# EAGLE schematic Pre_schV2 (EAGLE 9.6.2)
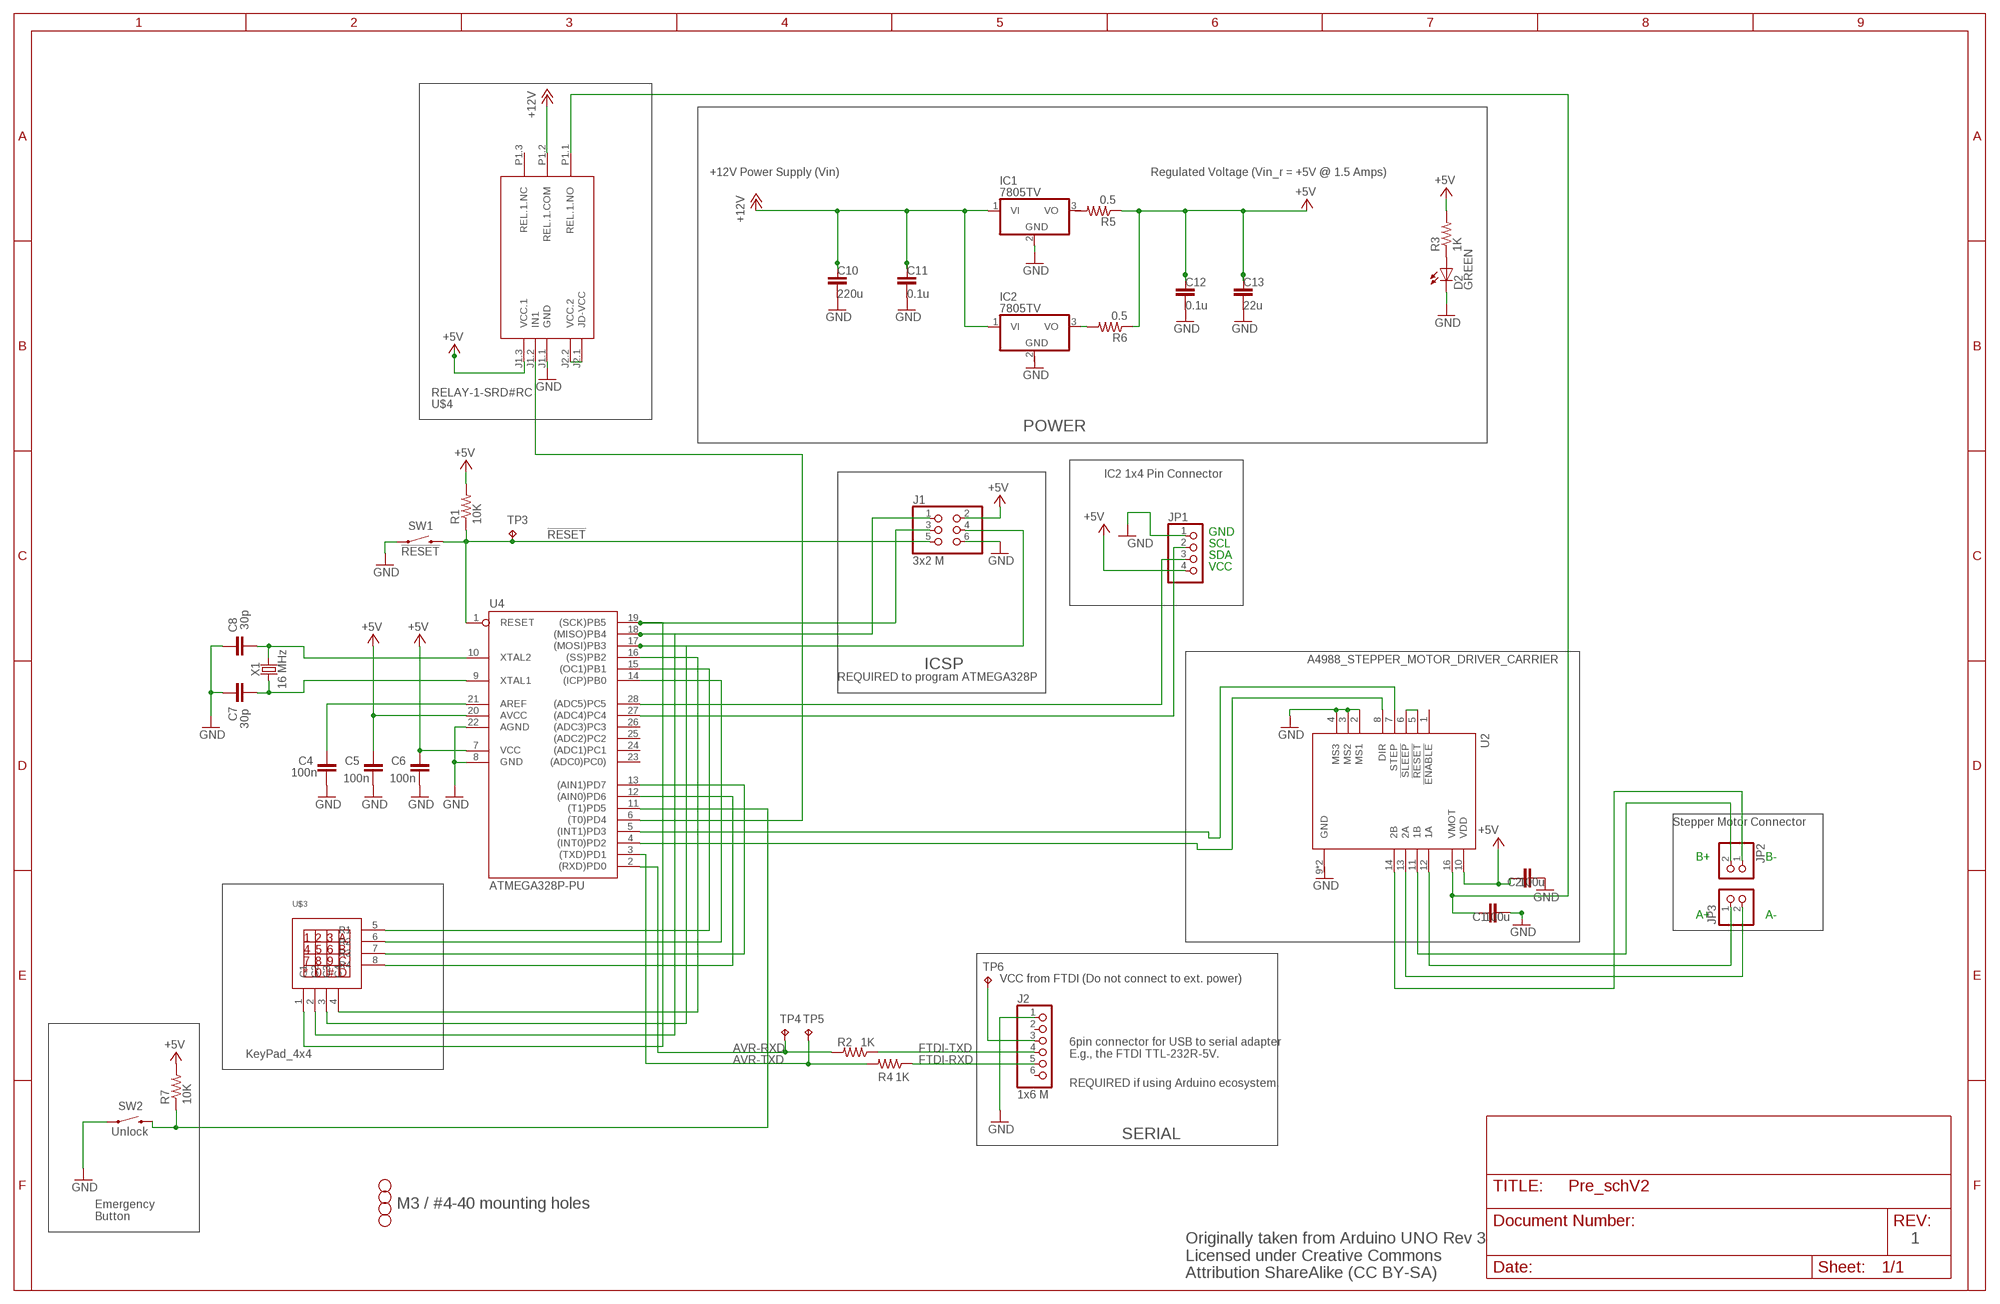
[diagram p0: schematic, sheet 1]

## Parts
C1  100u  C-EUC0805K  [C0805K]
C2  100u  C-EUC0805K  [C0805K]
C4  100n  C-EUC0805K  [C0805K]
C5  100n  C-EUC0805K  [C0805K]
C6  100n  C-EUC0805K  [C0805K]
C7  30p  C-EUC0805K  [C0805K]
C8  30p  C-EUC0805K  [C0805K]
C10  220u  C-EUC0805K  [C0805K]
C11  0.1u  C-EUC0805K  [C0805K]
C12  0.1u  C-EUC0805K  [C0805K]
C13  22u  C-EUC0805K  [C0805K]
D2  GREEN  LEDCHIP-LED0805  [CHIP-LED0805]
H1  STAND-OFF  [STAND-OFF]
H2  STAND-OFF  [STAND-OFF]
H3  STAND-OFF  [STAND-OFF]
H4  STAND-OFF  [STAND-OFF]
IC1  7805TV  [TO220V]
IC2  7805TV  [TO220V]
J1  3x2 M  PINHD-2X3  [2X03]
J2  1x6 M  PINHD-1X6  [1X06]
JP1  PINHD-1X4  [1X04]
JP2  PINHD-1X2  [1X02]
JP3  PINHD-1X2  [1X02]
R1  10K  R-US_R0805  [R0805]
R2  1K  R-US_R0805  [R0805]
R3  1K  R-US_R0805  [R0805]
R4  1K  R-US_R0805  [R0805]
R5  0.5  R-US_R0805  [R0805]
R6  0.5  R-US_R0805  [R0805]
R7  10K  R-US_R0805  [R0805]
SW1  !RESET  SWITCH-MOMENTARY-2SMD  [TACTILE_SWITCH_SMD]
SW2  Unlock  SWITCH-MOMENTARY-2SMD  [TACTILE_SWITCH_SMD]
TP3  TPPAD1-13  [P1-13]
TP4  TPPAD1-13  [P1-13]
TP5  TPPAD1-13  [P1-13]
TP6  TPPAD1-13  [P1-13]
U2  A4988_STEPPER_MOTOR_DRIVER_CARRIER  [MODULE_A4988_STEPPER_MOTOR_DRIVER_CARRIER]
U4  ATMEGA328P-PU  [DIL28-3]
U$3  KEYPAD4X4  [KEYPAD4X4]
U$4  RELAY-1-SRD#RC  [RELAY-1-SRD#RC]
X1  16 MHz  CRYSTALSMD-HC49UP  [HC49UP]

## Nets
!RESET: J1.5 R1.1 SW1.3 TP3.TP U4.1(RESET)
+5V: C2.2 C5.2 C6.2 C12.2 C13.2 J1.2 JP1.4 R1.2 R3.2 R5.1 R6.1 R7.2 U2.10(VDD) U4.7(VCC) U4.20(AVCC) U$4.J1.3(VCC.1)
+12V: C10.2 C11.2 IC1.1(VI) IC2.1(VI) U$4.P1.2(REL.1.COM)
AVR-RXD: R2.2 TP4.TP U4.2((RXD)PD0)
AVR-TXD: R4.2 TP5.TP U4.3((TXD)PD1)
FTDI-RXD: J2.5 R4.1
FTDI-TXD: J2.4 R2.1
GND: C1.1 C2.1 C4.1 C5.1 C6.1 C7.2 C8.2 C10.1 C11.1 C12.1 C13.1 D2.C IC1.2(GND) J1.6 J2.1 JP1.1 SW1.1 SW2.1 U2.2(MS1) U2.3(MS2) U2.4(MS3) U4.8(GND) U4.22(AGND) U$4.J1.1(GND)
MISO: J1.1 U4.18((MISO)PB4) U$3.2(C2)
MOSI: J1.4 U4.17((MOSI)PB3) U$3.3(C3)
N$1: C4.2 U4.21(AREF)
N$2: U2.8(DIR) U4.4((INT0)PD2)
N$3: D2.A R3.1
N$4: U2.7(STEP) U4.5((INT1)PD3)
N$5: J2.3 TP6.TP
N$6: JP1.2 U4.27((ADC4)PC4)
N$7: U2.5(!RESET) U2.6(!SLEEP)
N$8: JP2.2 U2.11(1B)
N$9: JP3.1 U2.12(1A)
N$10: JP3.2 U2.13(2A)
N$11: JP2.1 U2.14(2B)
N$12: JP1.3 U4.28((ADC5)PC5)
N$13: IC2.3(VO) R6.2
N$14: U4.12((AIN0)PD6) U$3.8(R4)
N$15: U4.13((AIN1)PD7) U$3.7(R3)
N$16: U4.14((ICP)PB0) U$3.6(R2)
N$17: U4.15((OC1)PB1) U$3.5(R1)
N$18: U4.16((SS)PB2) U$3.4(C4)
N$19: U$4.J2.1(JD-VCC) U$4.J2.2(VCC.2)
N$20: U4.6((T0)PD4) U$4.J1.2(IN1)
N$21: R7.1 SW2.3 U4.11((T1)PD5)
N$23: C1.2 U2.16(VMOT) U$4.P1.1(REL.1.NO)
SCK: J1.3 U4.19((SCK)PB5) U$3.1(C1)
XTAL1: C7.1 U4.9(XTAL1) X1.1
XTAL2: C8.1 U4.10(XTAL2) X1.2
Unconnected: IC1.3(VO) IC2.2(GND) J2.2 J2.6 R5.2 U2.1(!ENABLE) U4.23((ADC0)PC0)) U4.24((ADC1)PC1) U4.25((ADC2)PC2) U4.26((ADC3)PC3) U$4.P1.3(REL.1.NC)

## Notes on the sheet
- +12V Power Supply (Vin) | Regulated Voltage (Vin_r = +5V @ 1.5 Amps)
- POWER
- IC2 1x4 Pin Connector
- GND
- SCL
- SDA
- VCC
- ICSP
- REQUIRED to program ATMEGA328P
- Stepper Motor Connector
- B+ | B-
- A+ | A-
- VCC from FTDI (Do not connect to ext. power)
- KeyPad_4x4
- 6pin connector for USB to serial adapter
  E.g., the FTDI TTL-232R-5V.
- REQUIRED if using Arduino ecosystem.
- SERIAL
- M3 / #4-40 mounting holes
- Emergency
  Button
- 1
- Originally taken from Arduino UNO Rev 3
  Licensed under Creative Commons 
  Attribution ShareAlike (CC BY-SA)

## Power pins joined to a net without a drawn wire
GND: U2.9(GND) U2.15(GND)

## Library data of the parts
C1 C2 C4-C6 C10-C13 = rcl:C-EU: CAPACITOR, European symbol; MFR: Samsung; MPN: CL21B104KBCNNNC; SPICEPREFIX: C
C7 = rcl:C-EU: CAPACITOR, European symbol; DESC: CAP CER 30PF 50V C0G/NP0 0805; MFR: Samsung; MPN: CL21C180JBANNNC; SPICEPREFIX: C
C8 = rcl:C-EU: CAPACITOR, European symbol; DESC: CAP CER 30PF 50V C0G/NP0 0805; MFR: Samsung; MPN: CL21C300JBANNNC; SPICEPREFIX: C
D2 = led:LED: LED OSRAM: - CHIPLED LG R971, LG N971, LY N971, LG Q971, LY Q971, LO R971, LY R971 LH N974, LH R974 LS Q976, LO Q976, LY Q976 LO Q996 - Hyper CHIPLED LW Q18S LB Q993, LB Q99A, LB R99A - SideLED LS A670, LO A670, LY A670, LG A670, LP A670 LB A673, LV A673, LT A673, LW A673 LH A674 LY A675 LS A676, LA A676, LO A676, LY A676, LW A676 LS A679, LY A679, LG A679 - Hyper Micro SIDELED® LS Y876, LA Y876, LO Y876, LY Y876 LT Y87S - SmartLED LW L88C, LW L88S LB L89C, LB L89S, LG L890 LS L89K, LO L89K, LY L89K LS L896, LA L896, LO L896, LY L896 - TOPLED LS T670, LO T670, LY T670, LG T670, LP T670 LSG T670, LSP T670, LSY T670, LOP T670, LYG T670 LG T671, LOG T671, LSG T671 LB T673, LV T673, LT T673, LW T673 LH T674 LS T676, LA T676, LO T676, LY T676, LB T676, LH T676, LSB T676, LW T676 LB T67C, LV T67C, LT T67C, LS T67K, LO T67K, LY T67K, LW E67C LS E67B, LA E67B, LO E67B, LY E67B, LB E67C, LV E67C, LT E67C LW T67C LS T679, LY T679, LG T679 LS T770, LO T770, LY T770, LG T770, LP T770 LB T773, LV T773, LT T773, LW T773 LH T774 LS E675, LA E675, LY E675, LS T675 LS T776, LA T776, LO T776, LY T776, LB T776 LHGB T686 LT T68C, LB T68C - Hyper Mini TOPLED® LB M676 - Mini TOPLED Santana® LG M470 LS M47K, LO M47K, LY M47K Source: http://www.osram.convergy.de LUXEON: - LUMILED® LXK2-PW12-R00, LXK2-PW12-S00, LXK2-PW14-U00, LXK2-PW14-V00 LXK2-PM12-R00, LXK2-PM12-S00, LXK2-PM14-U00 LXK2-PE12-Q00, LXK2-PE12-R00, LXK2-PE12-S00, LXK2-PE14-T00, LXK2-PE14-U00 LXK2-PB12-K00, LXK2-PB12-L00, LXK2-PB12-M00, LXK2-PB14-N00, LXK2-PB14-P00, LXK2-PB14-Q00 LXK2-PR12-L00, LXK2-PR12-M00, LXK2-PR14-Q00, LXK2-PR14-R00 LXK2-PD12-Q00, LXK2-PD12-R00, LXK2-PD12-S00 LXK2-PH12-R00, LXK2-PH12-S00 LXK2-PL12-P00, LXK2-PL12-Q00, LXK2-PL12-R00 Source: www.luxeon.com KINGBRIGHT: KA-3528ASYC Source: www.kingbright.com; MFR: Würth Elektronik; MPN: 150080GS75000
H1-H4 = SparkFun-Hardware:STAND-OFF: Stand Off Drill holes for mechanically mounting via screws, standoffs, etc. Note: Use the keepout ring to avoid running the screw head into surrounding components. Variant Overviews STAND-OFF - Mechanical footprint for a #4 phillips button head screw. STAND-OFF-TIGHT - Mechanical footprint for a #4 phillips button head screw, Example SparkFun Products Screw - Phillips Head (1/4", 4-40, 10 pack) <https://www.sparkfun.com/products/10453> (PRT-10453) Screw - Phillips Head (1/2", 4-40, 10 pack) <https://www.sparkfun.com/products/10452> (PRT-10452) Screw - Phillips Head (3/4", 4-40, 10 pack) <https://www.sparkfun.com/products/10451> (PRT-10451) Screw - Phillips Head (1", 4-40, 10 pack) <https://www.sparkfun.com/products/10450> (PRT-10450)
IC1 IC2 = linear:78*: Positive VOLTAGE REGULATOR Source: http://cache.national.com/ds/LM/LM78L05.pdf http://www.fairchildsemi.com/ds/LM/LM7805.pdf
J1 = SmartPrj:PINHD-2X3: PIN HEADER; MFR: Harwin; MPN: M20-9980345
J2 = pinhead:PINHD-1X6: PIN HEADER; MFR: Sullins; MPN: PRPC006SAAN-RC
JP1 = pinhead:PINHD-1X4: PIN HEADER
JP2 JP3 = pinhead:PINHD-1X2: PIN HEADER
R1 R7 = rcl:R-US_: RESISTOR, American symbol; MFR: Yageo; MPN: RC0805FR-0710KL; SPICEPREFIX: R
R2-R6 = rcl:R-US_: RESISTOR, American symbol; MFR: Yageo; MPN: RC0805FR-071KL; SPICEPREFIX: R
SW1 SW2 = SparkFun-Electromechanical:SWITCH-MOMENTARY-2: Various NO switches- pushbuttons, reed, etc; DESC: SWITCH TACTILE SPST-NO 0.05A 12V; MFR: C&K; MPN: RS-187R05A2-DS MT RT
TP3-TP6 = testpad:TP: Test pad
U2 = A4988_STEPPER_MOTOR_DRIVER_CARRIER:A4988_STEPPER_MOTOR_DRIVER_CARRIER: Stepper motor controler; IC: A4988; 1A; Uin mot: 8÷35V; AVAILABILITY: Unavailable; DESCRIPTION: Stepper Motor Driver; MF: Pololu; MP: A4988 STEPPER MOTOR DRIVER CARRIER; PACKAGE: None; PRICE: None
U4 = SmartPrj:ATMEGA328P-: MICROCONTROLLER 4 Kbytes FLASH 128 bytes SRAM 256 bytes EEPROM UART 6-channel 10 bit ADC; MFR: Microchip; MPN: ATMEGA328P-PU
U$3 = keypad_4x4_raw:KEYPAD4X4
U$4 = diy-modules:RELAY-1-SRD#RC: 1-Channel Relay Module based on SRD-05VDC-SL-C relays Symbol with relays pins Click here to find device on ebay.com <http://www.ebay.com/sch/one+channel+isolated+relay+5v>
X1 = SparkFun-Clocks:CRYSTAL: Crystals (Generic) These are passive quartz crystals, which can be used as a clock source for a microcontroller. Crystal's are two-terminal devices. They require external "load" capacitors to generate an oscillating signal.; DESC: CRYSTAL 16.000 MHZ 18PF SMD; MFR: ECS; MPN: ECS-160-18-5PX-TR

## Net classes
0 default: width 0.254 mm, clearance 0.254 mm